# Altium schematic sheet Triton.SCHDOC
size B
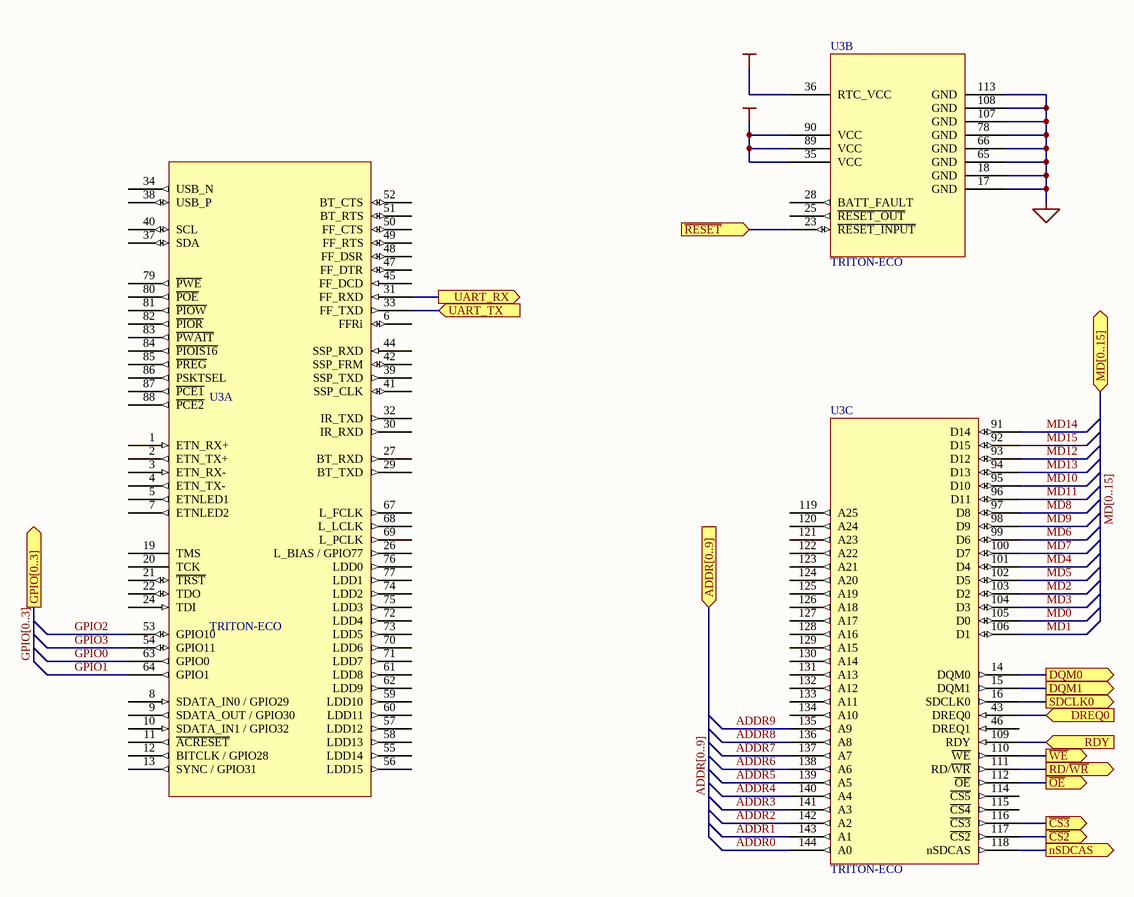
[diagram p0: Triton.SCHDOC]

## Parts
U3  TRITON-ECO  [144-PIN SMT SODIMM]  (parts A,B,C of 3)

## Ports
ADDR[0..9] (in), DQM0 (out), DQM1 (out), DREQ0 (in), GPIO[0..3] (out), MD[0..15] (bidir), nSDCAS (out), RD/~{WR} (out), RDY (in), SDCLK0 (out), UART_RX (out), UART_TX (in), ~{CS2} (out), ~{CS3} (out), ~{OE} (out), ~{RESET} (in), ~{WE} (out)

## Nets
GND: U3.17(GND) U3.18(GND) U3.65(GND) U3.66(GND) U3.78(GND) U3.107(GND) U3.108(GND) U3.113(GND)
VCC: U3.35(VCC) U3.36(RTC_VCC) U3.89(VCC) U3.90(VCC)
ADDR0: U3.144(A0)
ADDR1: U3.143(A1)
ADDR2: U3.142(A2)
ADDR3: U3.141(A3)
ADDR4: U3.140(A4)
ADDR5: U3.139(A5)
ADDR6: U3.138(A6)
ADDR7: U3.137(A7)
ADDR8: U3.136(A8)
ADDR9: U3.135(A9)
~{CS2}: U3.117(~{CS2}) ; port ~{CS2}
~{CS3}: U3.116(~{CS3}) ; port ~{CS3}
DQM0: U3.14(DQM0) ; port DQM0
DQM1: U3.15(DQM1) ; port DQM1
DREQ0: U3.43(DREQ0) ; port DREQ0
GPIO0: U3.63(GPIO0)
GPIO1: U3.64(GPIO1)
GPIO2: U3.53(GPIO10)
GPIO3: U3.54(GPIO11)
MD0: U3.105(D0)
MD1: U3.106(D1)
MD2: U3.103(D2)
MD3: U3.104(D3)
MD4: U3.101(D4)
MD5: U3.102(D5)
MD6: U3.99(D6)
MD7: U3.100(D7)
MD8: U3.97(D8)
MD9: U3.98(D9)
MD10: U3.95(D10)
MD11: U3.96(D11)
MD12: U3.93(D12)
MD13: U3.94(D13)
MD14: U3.91(D14)
MD15: U3.92(D15)
nSDCAS: U3.118(nSDCAS) ; port nSDCAS
~{OE}: U3.112(~{OE}) ; port ~{OE}
~{RESET}: U3.23(~{RESET_INPUT}) ; port ~{RESET}
RD/~{WR}: U3.111(RD/~{WR}) ; port RD/~{WR}
RDY: U3.109(RDY) ; port RDY
SDCLK0: U3.16(SDCLK0) ; port SDCLK0
UART_RX: U3.31(FF_RXD) ; port UART_RX
UART_TX: U3.33(FF_TXD) ; port UART_TX
~{WE}: U3.110(~{WE}) ; port ~{WE}

Not connected (* = marked no-connect by the designer): U3 1(ETN_RX+) 2(ETN_TX+) 3(ETN_RX-) 4(ETN_TX-) 5(ETNLED1) 6(FFRi) 7(ETNLED2) 8(SDATA_IN0_/_GPIO29) 9(SDATA_OUT_/_GPIO30) 10(SDATA_IN1_/_GPIO32) 11(~{ACRESET}) 12(BITCLK_/_GPIO28) 13(SYNC_/_GPIO31) 19(TMS) 20(TCK) 21(~{TRST}) 22(TDO) 24(TDI) 25(~{RESET_OUT}) 26(L_BIAS_/_GPIO77) 27(BT_RXD) 28(BATT_FAULT) 29(BT_TXD) 30(IR_RXD) 32(IR_TXD) 34(USB_N) 37(SDA) 38(USB_P) 39(SSP_TXD) 40(SCL) 41(SSP_CLK) 42(SSP_FRM) 44(SSP_RXD) 45(FF_DCD) 46(DREQ1) 47(FF_DTR) 48(FF_DSR) 49(FF_RTS) 50(FF_CTS) 51(BT_RTS) 52(BT_CTS) 55(LDD14) 56(LDD15) 57(LDD12) 58(LDD13) 59(LDD10) 60(LDD11) 61(LDD8) 62(LDD9) 67(L_FCLK) 68(L_LCLK) 69(L_PCLK) 70(LDD6) 71(LDD7) 72(LDD4) 73(LDD5) 74(LDD2) 75(LDD3) 76(LDD0) 77(LDD1) 79(~{PWE}) 80(~{POE}) 81(~{PIOW}) 82(~{PIOR}) 83(~{PWAIT}) 84(~{PIOIS16}) 85(~{PREG}) 86(PSKTSEL) 87(~{PCE1}) 88(~{PCE2}) 114(~{CS5}) 115(~{CS4}) 119(A25) 120(A24) 121(A23) 122(A22) 123(A21) 124(A20) 125(A19) 126(A18) 127(A17) 128(A16) 129(A15) 130(A14) 131(A13) 132(A12) 133(A11) 134(A10)

## Buses and harness runs
bus ADDR[0..9] = port ADDR[0..9]
bus GPIO[0..3] = port GPIO[0..3]
bus MD[0..15] = port MD[0..15]

## Library data of the parts
U3 = TRITON_ECO: Triton-ECO 400 MHz XScale DIMM